# Altium schematic sheet RS485_Demo_Bord_v1.0 - 副本.SchDoc
size A0
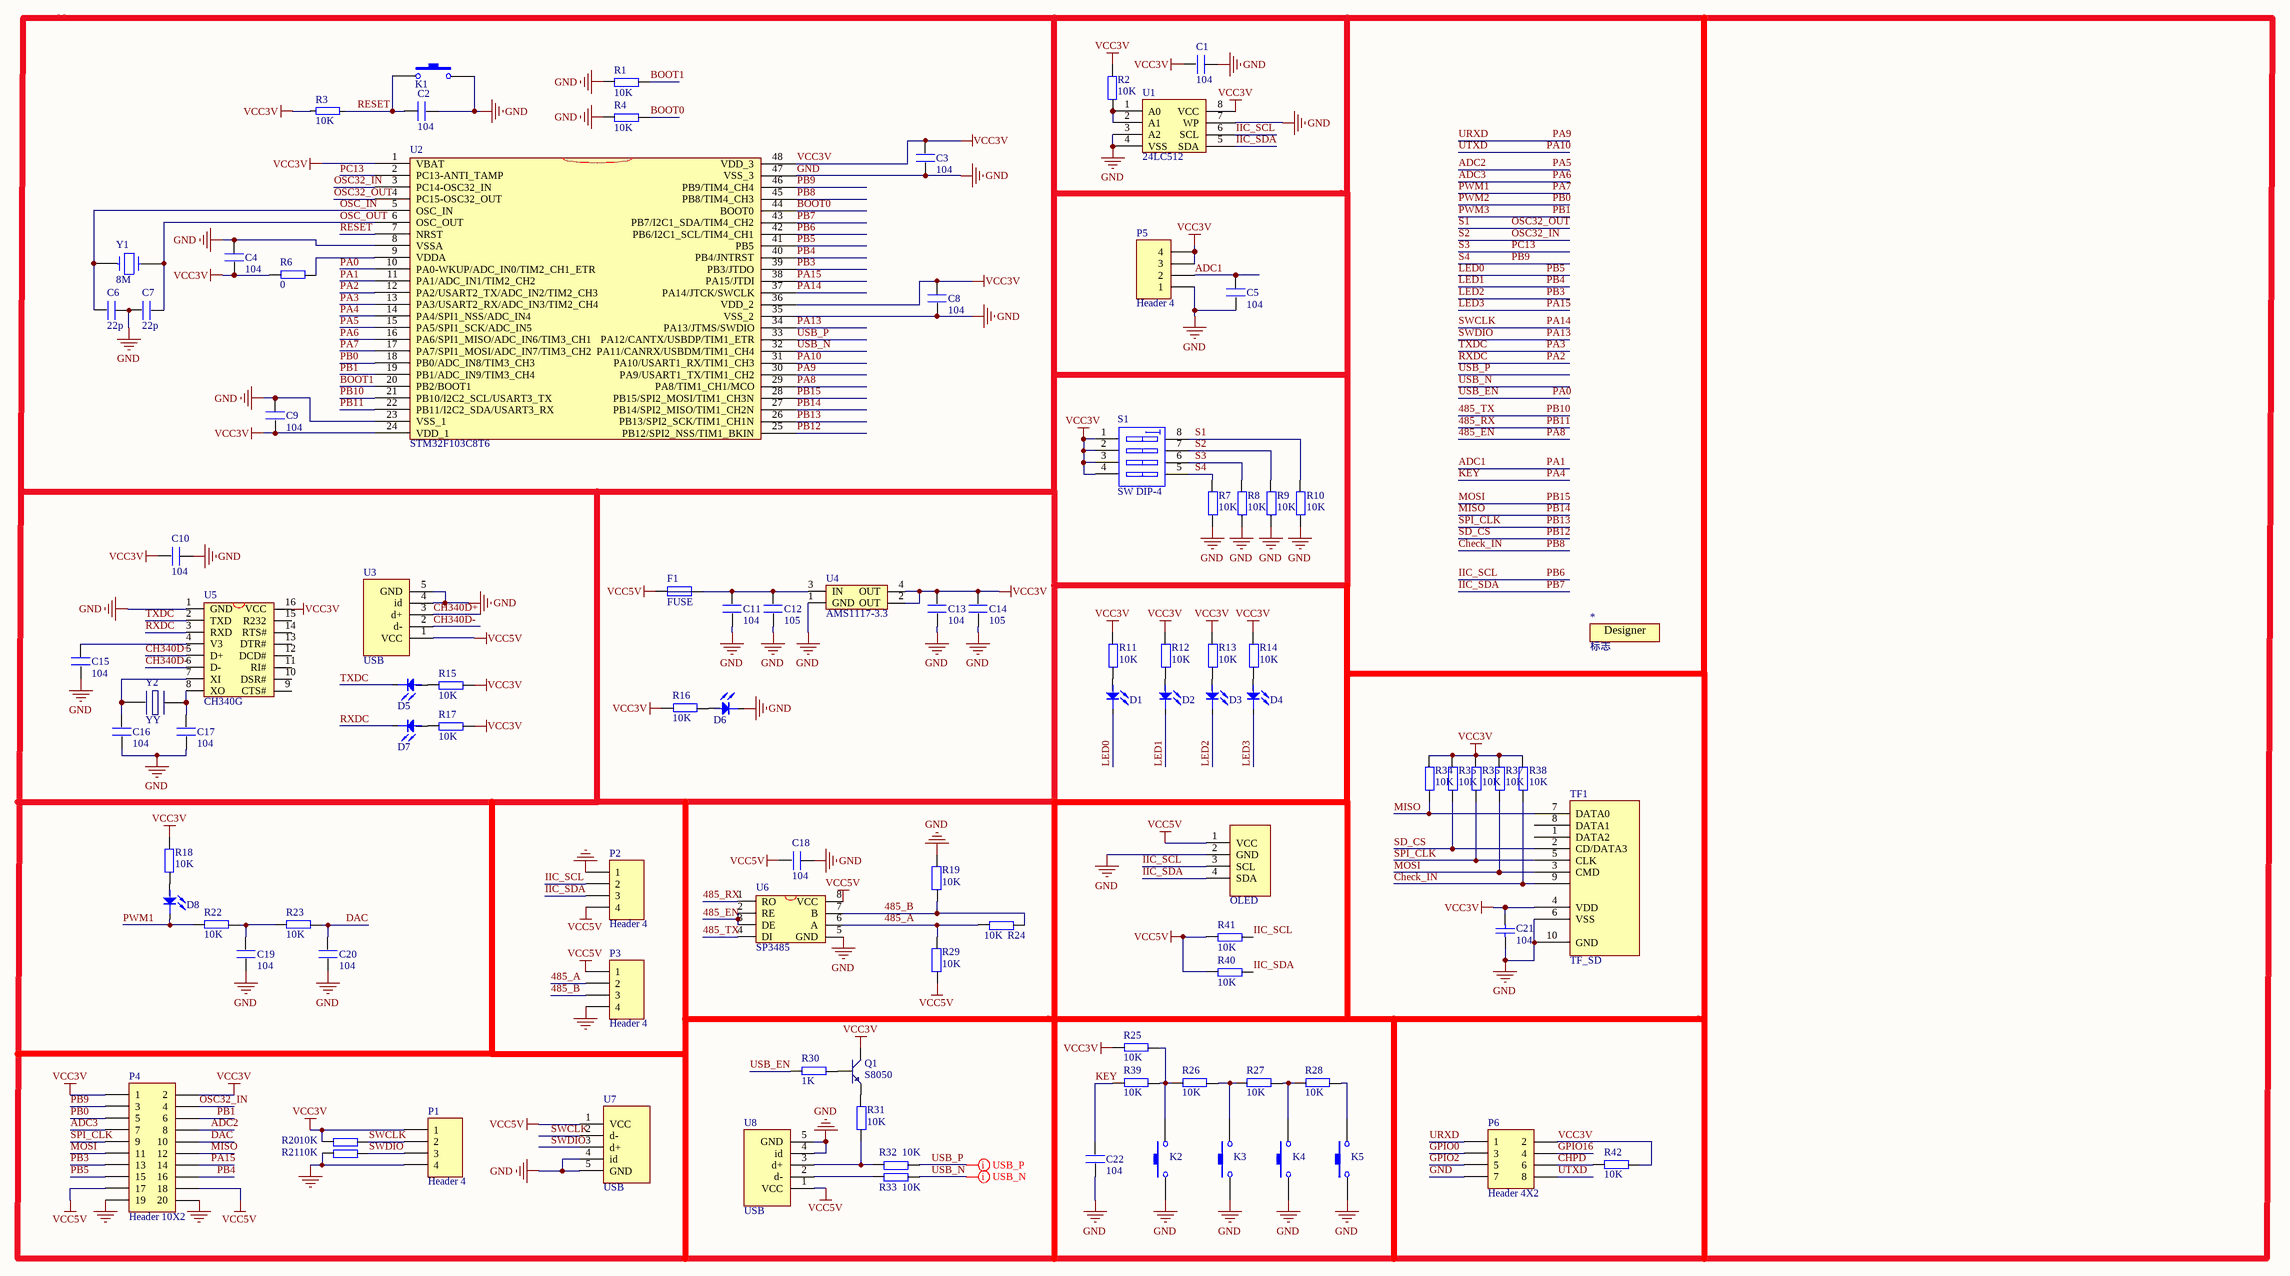
[diagram p0: RS485_Demo_Bord_v1.0 - 副本.SchDoc]

## Parts
*  标志  [Designer - 1]
C1  104  [C_0805]
C2  104  [C_0805]
C3  104  [C_0805]
C4  104  [C_0805]
C5  104  [C_0805]
C6  22p  [C_0805]
C7  22p  [C_0805]
C8  104  [C_0805]
C9  104  [C_0805]
C10  104  [C_0805]
C11  104  [C_0805]
C12  105  [C_0805]
C13  104  [C_0805]
C14  105  [C_0805]
C15  104  [C_0805]
C16  104  [C_0805]
C17  104  [C_0805]
C18  104  [C_0805]
C19  104  [C_0805]
C20  104  [C_0805]
C21  104  [0805C]
C22  104  [C_0805]
D1  LED  [0805-LED-RED]  (value not drawn)
D2  LED  [0805-LED-RED]  (value not drawn)
D3  LED  [0805-LED-RED]  (value not drawn)
D4  LED  [0805-LED-RED]  (value not drawn)
D5  LED  [0805-LED-RED]  (value not drawn)
D6  LED  [0805-LED-RED]  (value not drawn)
D7  LED  [0805-LED-RED]  (value not drawn)
D8  LED  [0805-LED-RED]  (value not drawn)
F1  FUSE  [0805]
K1  KEY  [KEY_6]  (value not drawn)
K2  KEY  [KEY_6]  (value not drawn)
K3  KEY  [KEY_6]  (value not drawn)
K4  KEY  [KEY_6]  (value not drawn)
K5  KEY  [KEY_6]  (value not drawn)
OLED  OLED  [OLED__IIC_1]  (value not drawn)
P1  Header 4  [XH_4_V]
P2  Header 4  [XH_4_V]
P3  Header 4  [XH_4_V]
P4  Header 10X2  [JTAG_20 - E]
P5  Header 4  [XH_4_V]
P6  Header 4X2  [HDR2X4]
Q1  S8050  [SOT23-3]
R1  10K  [0805]
R2  10K  [0805]
R3  10K  [0805]
R4  10K  [0805]
R6  0  [0805]
R7  10K  [0805]
R8  10K  [0805]
R9  10K  [0805]
R10  10K  [0805]
R11  10K  [0805]
R12  10K  [0805]
R13  10K  [0805]
R14  10K  [0805]
R15  10K  [0805]
R16  10K  [0805]
R17  10K  [0805]
R18  10K  [0805]
R19  10K  [0805]
R20  10K  [0805]
R21  10K  [0805]
R22  10K  [0805]
R23  10K  [0805]
R24  10K  [0805]
R25  10K  [0805]
R26  10K  [0805]
R27  10K  [0805]
R28  10K  [0805]
R29  10K  [0805]
R30  1K  [0805]
R31  10K  [0805]
R32  10K  [0805]
R33  10K  [0805]
R34  10K  [0805]
R35  10K  [0805]
R36  10K  [0805]
R37  10K  [0805]
R38  10K  [0805]
R39  10K  [0805]
R40  10K  [0805]
R41  10K  [0805]
R42  10K  [0805]
S1  SW DIP-4  [SWITCH_DIP-4]
TF1  TF_SD  [TF_SD]
U1  24LC512  [SO-8]
U2  STM32F103C8T6  [LQFP-48_M]
U3  USB  [USB_MICRO_F]
U4  AMS1117-3.3  [SOT223]
U5  CH340G  [SO-16]
U6  SP3485  [SOP-8]
U7  USB  [USB_MICRO_F]
U8  USB  [USB_MICRO_F]
Y1  8M  [XTAL-3]
Y2  YY  [XTAL-3]

## Nets
GND: C1.1 C2.2 C3.1 C4.2 C5.1 C6.1 C7.2 C8.1 C9.2 C10.1 C11.1 C12.1 C13.1 C14.1 C15.1 C16.1 C17.1 C18.1 C19.1 C20.1 C21.1 C22.1 D6.K K1.2 K2.1 K3.1 K4.1 K5.1 OLED.2(GND) P1.4 P2.1 P3.4 P4.19 P4.20 P5.1 P6.7 R1.1 R4.1 R7.1 R8.1 R9.1 R10.1 R19.1 R21.1 TF1.6(VSS) TF1.10(GND) U1.3(A2) U1.4(VSS) U1.7(WP) U2.8(VSSA) U2.23(VSS_1) U2.35(VSS_2) U2.47(VSS_3) U3.4(id) U3.5(GND) U4.1(GND) U5.1(GND) U6.5(GND) U7.4(id) U7.5(GND) U8.4(id) U8.5(GND)
VCC3V: C1.2 C3.2 C4.1 C8.2 C9.1 C10.2 C13.2 C14.2 C21.2 P1.1 P4.1 P4.2 P5.3 P5.4 P6.2 Q1.2(C) R2.1 R3.2 R6.2 R11.2 R12.2 R13.2 R14.2 R15.2 R16.2 R17.2 R18.1 R20.1 R25.2 R34.2 R35.2 R36.2 R37.2 R38.2 R42.1 S1.1(A1) S1.2(A2) S1.3(A3) S1.4(A4) TF1.4(VDD) U1.8(VCC) U2.1(VBAT) U2.24(VDD_1) U2.36(VDD_2) U2.48(VDD_3) U4.2(OUT) U4.4(OUT) U5.16(VCC)
VCC5V: C18.2 F1.1 OLED.1(VCC) P2.4 P3.1 P4.17 P4.18 R29.2 R40.1 R41.1 U3.1(VCC) U6.8(VCC) U7.1(VCC) U8.1(VCC)
485_A: P3.2 R24.1 R29.1 U6.6(A)
485_B: P3.3 R19.2 R24.2 U6.7(B)
485_EN: U2.29(PA8/TIM1_CH1/MCO) U6.2(RE) U6.3(DE)  [also labelled PA8]
485_RX: U2.22(PB11/I2C2_SDA/USART3_RX) U6.1(RO)  [also labelled PB11]
485_TX: U2.21(PB10/I2C2_SCL/USART3_TX) U6.4(DI)  [also labelled PB10]
ADC1: C5.2 P5.2 U2.11(PA1/ADC_IN1/TIM2_CH2)  [also labelled PA1]
ADC2: P4.8 U2.15(PA5/SPI1_SCK/ADC_IN5)  [also labelled PA5]
ADC3: P4.7 U2.16(PA6/SPI1_MISO/ADC_IN6/TIM3_CH1)  [also labelled PA6]
BOOT0: R4.2 U2.44(BOOT0)
BOOT1: R1.2 U2.20(PB2/BOOT1)
CH340D+: U3.3(d+) U5.5(D+)
CH340D-: U3.2(d-) U5.6(D-)
Check_IN: R38.1 TF1.9(VSS) U2.45(PB8/TIM4_CH3)  [also labelled PB8]
CHPD: P6.6 R42.2
DAC: C20.2 P4.10 R23.1
GPIO0: P6.3
GPIO2: P6.5
GPIO16: P6.4
IIC_SCL: OLED.3(SCL) P2.2 R41.2 U1.6(SCL) U2.42(PB6/I2C1_SCL/TIM4_CH1)  [also labelled PB6]
IIC_SDA: OLED.4(SDA) P2.3 R40.2 U1.5(SDA) U2.43(PB7/I2C1_SDA/TIM4_CH2)  [also labelled PB7]
KEY: C22.2 R39.2 U2.14(PA4/SPI1_NSS/ADC_IN4)  [also labelled PA4]
LED0: D1.K P4.15 U2.41(PB5)  [also labelled PB5]
LED1: D2.K P4.16 U2.40(PB4/JNTRST)  [also labelled PB4]
LED2: D3.K P4.13 U2.39(PB3/JTDO)  [also labelled PB3]
LED3: D4.K P4.14 U2.38(PA15/JTDI)  [also labelled PA15]
MISO: P4.12 R34.1 TF1.7(DATA0) U2.27(PB14/SPI2_MISO/TIM1_CH2N)  [also labelled PB14]
MOSI: P4.11 R37.1 TF1.3(CMD) U2.28(PB15/SPI2_MOSI/TIM1_CH3N)  [also labelled PB15]
OSC32_IN: P4.4 R9.2 S1.7(B2) U2.3(PC14-OSC32_IN)  [also labelled S2]
OSC32_OUT: R10.2 S1.8(B1) U2.4(PC15-OSC32_OUT)  [also labelled S1]
OSC_IN: C6.2 U2.5(OSC_IN) Y1.1
OSC_OUT: C7.1 U2.6(OSC_OUT) Y1.2
PA0: R30.2 U2.10(PA0-WKUP/ADC_IN0/TIM2_CH1_ETR)  [also labelled USB_EN]
PA2: D7.K U2.12(PA2/USART2_TX/ADC_IN2/TIM2_CH3) U5.3(RXD)  [also labelled RXDC]
PA3: D5.K U2.13(PA3/USART2_RX/ADC_IN3/TIM2_CH4) U5.2(TXD)  [also labelled TXDC]
PA7: D8.K R22.2 U2.17(PA7/SPI1_MOSI/ADC_IN7/TIM3_CH2)  [also labelled PWM1]
PA9: P6.1 U2.30(PA9/USART1_TX/TIM1_CH2)  [also labelled URXD]
PA10: P6.8 U2.31(PA10/USART1_RX/TIM1_CH3)  [also labelled UTXD]
PA13: P1.3 R21.2 U2.34(PA13/JTMS/SWDIO) U7.3(d+)  [also labelled SWDIO]
PA14: P1.2 R20.2 U2.37(PA14/JTCK/SWCLK) U7.2(d-)  [also labelled SWCLK]
PB0: P4.5 U2.18(PB0/ADC_IN8/TIM3_CH3)  [also labelled PWM2]
PB1: P4.6 U2.19(PB1/ADC_IN9/TIM3_CH4)  [also labelled PWM3]
PB9: P4.3 R7.2 S1.5(B4) U2.46(PB9/TIM4_CH4)  [also labelled S4]
PB12: R35.1 TF1.2(CD/DATA3) U2.25(PB12/SPI2_NSS/TIM1_BKIN)  [also labelled SD_CS]
PB13: P4.9 R36.1 TF1.5(CLK) U2.26(PB13/SPI2_SCK/TIM1_CH1N)  [also labelled SPI_CLK]
PC13: R8.2 S1.6(B3) U2.2(PC13-ANTI_TAMP)  [also labelled S3]
RESET: C2.1 K1.1 R3.1 U2.7(NRST)
USB_N: R33.2 U2.32(PA11/CANRX/USBDM/TIM1_CH4)
USB_P: R32.2 U2.33(PA12/CANTX/USBDP/TIM1_ETR)
NetC11_2: C11.2 C12.2 F1.2 U4.3(IN)
NetC15_2: C15.2 U5.4(V3)
NetC16_2: C16.2 U5.7(XI) Y2.2
NetC17_2: C17.2 U5.8(XO) Y2.1
NetC19_2: C19.2 R22.1 R23.2
NetD1_A: D1.A R11.1
NetD2_A: D2.A R12.1
NetD3_A: D3.A R13.1
NetD4_A: D4.A R14.1
NetD5_A: D5.A R15.1
NetD6_A: D6.A R16.1
NetD7_A: D7.A R17.1
NetD8_A: D8.A R18.2
NetK2_2: K2.2 R25.1 R26.2 R39.1
NetK3_2: K3.2 R26.1 R27.2
NetK4_2: K4.2 R27.1 R28.2
NetK5_2: K5.2 R28.1
NetQ1_1: Q1.1(B) R30.1
NetQ1_3: Q1.3(E) R31.2
NetR2_2: R2.2 U1.1(A0) U1.2(A1)
NetR6_1: R6.1 U2.9(VDDA)
NetR31_1: R31.1 R32.1 U8.3(d+)
NetR33_1: R33.1 U8.2(d-)

Not connected (* = marked no-connect by the designer): TF1 1(DATA2) 8(DATA1); U5 9(CTS#) 10(DSR#) 11(RI#) 12(DCD#) 13(DTR#) 14(RTS#) 15(R232)

## Layout directives
differential pair: USB_N, USB_P

## Notes on the sheet
- (in symbol 标志) Designer

## Library data of the parts
C1-C20 C22 = C
C21 = Cap: Capacitor; Published: 8-Jun-2000; LatestRevisionDate: 17-Jul-2002; LatestRevisionNote: Re-released for DXP Platform.; Publisher: Altium Limited; Value: 104
OLED = OLED_IIC_1
P1-P3 P5 = Header 4: Header, 4-Pin; LatestRevisionDate: 17-Jul-2002; LatestRevisionNote: Re-released for DXP Platform.; Publisher: Altium Limited
P4 = Header 10X2: Header, 10-Pin, Dual row; LatestRevisionDate: 17-Jul-2002; LatestRevisionNote: Re-released for DXP Platform.; Publisher: Altium Limited
P6 = Header 4X2: Header, 4-Pin, Dual row; LatestRevisionDate: 17-Jul-2002; LatestRevisionNote: Re-released for DXP Platform.; Publisher: Altium Limited
Q1 = NPN: pin to pad: 2>3 3>2
R1 R2 R4 R6-R42 = R
R3 = RES
S1 = SW DIP-4: DIP Switch
U2 = STM32F103C6
U4 = AMS1117
U6 = MAX3485
Y1 = CRYSTAL